# Altium schematic sheet Sheet1.SchDoc
size A4
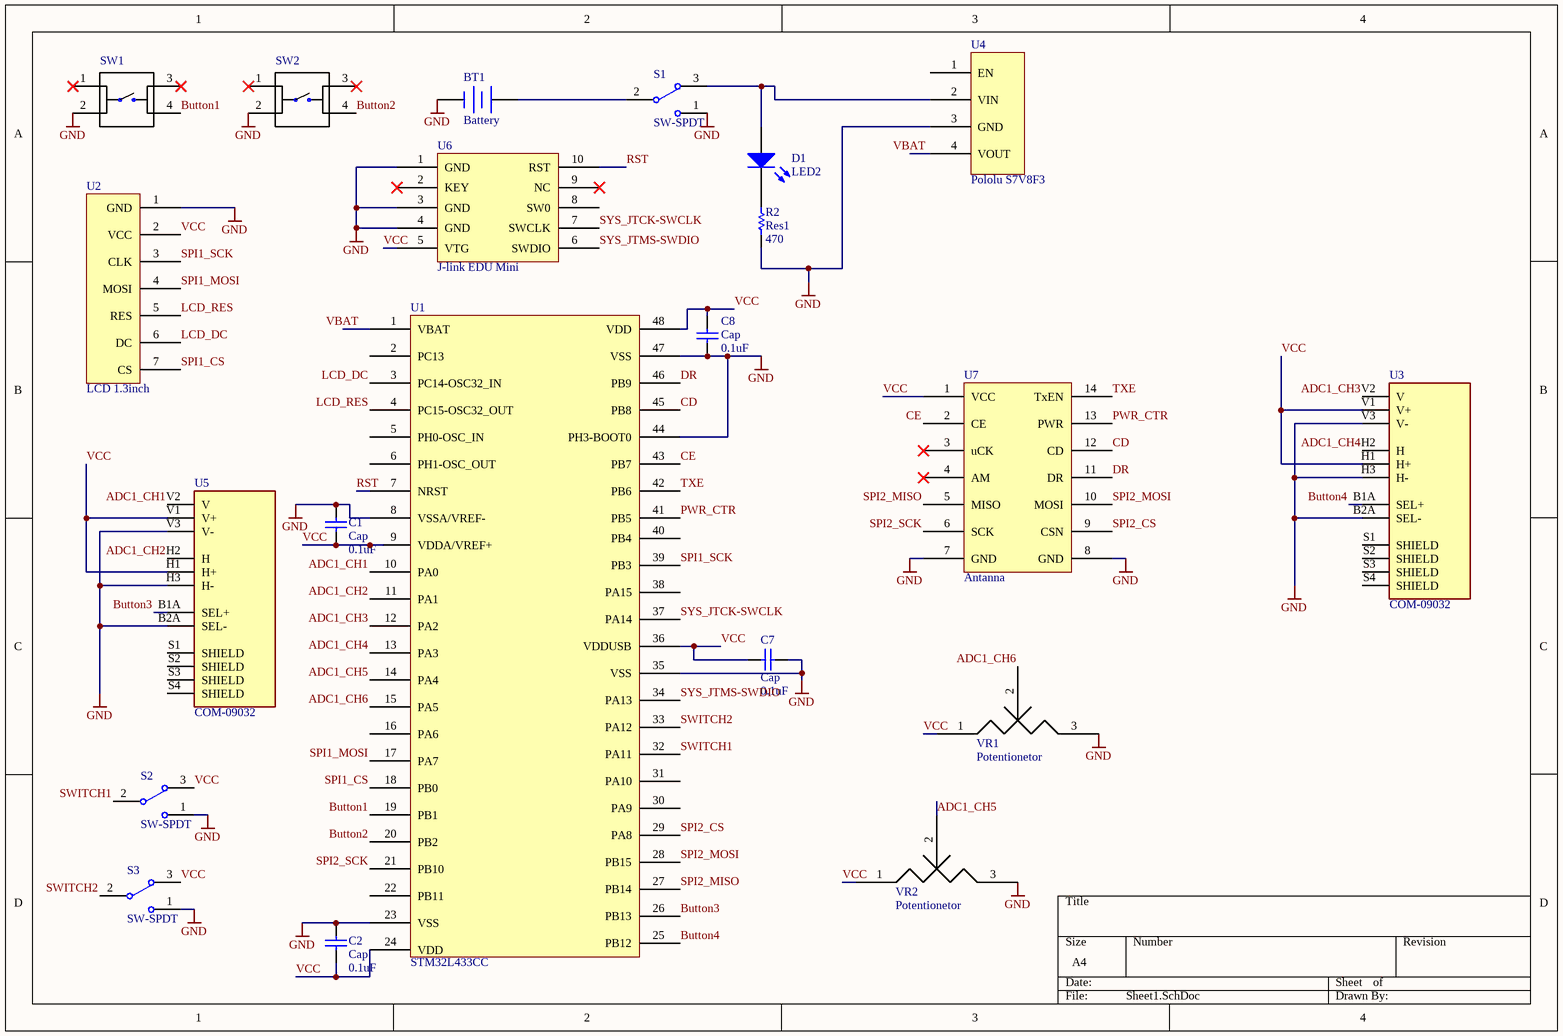
[diagram p0: Sheet1.SchDoc]

## Parts
BT1  Battery  [BAT-2]
C1  Cap  value 0.1uF  [RESC0603]
C2  Cap  value 0.1uF  [RESC0603]
C7  Cap  value 0.1uF  [RESC0603]
C8  Cap  value 0.1uF  [RESC0603]
D1  LED2  [LED1]
R2  Res1  value 470  [RESC0603]
S1  SW-SPDT  [Toggle switch]
S2  SW-SPDT  [Toggle switch]
S3  SW-SPDT  [Toggle switch]
SW1  1825910-6  [PUSHBUTTON SWITCH - duplicate]  (value not drawn)
SW2  1825910-6  [PUSHBUTTON SWITCH - duplicate]  (value not drawn)
U1  STM32L433CC  [LQFP48]
U2  LCD 1.3inch  [LCD]
U3  COM-09032  [XDCR_COM-09032]
U4  Pololu S7V8F3  [Pololu S7V8F3]
U5  COM-09032  [XDCR_COM-09032]
U6  J-link EDU Mini  [10 pin vertical]
U7  Antanna  [Antanna]
VR1  Potentionetor  [potentiometer]
VR2  Potentionetor  [potentiometer]

## Nets
GND: BT1.2(-) C1.2 C2.2 C7.1 C8.1 R2.1 S1.1 S2.1 S3.1 SW1.2 SW2.2 U1.8(VSSA/VREF-) U1.23(VSS) U1.35(VSS) U1.44(PH3-BOOT0) U1.47(VSS) U2.1(GND) U3.B2A(SEL-) U3.H3(H-) U3.V3(V-) U4.3(GND) U5.B2A(SEL-) U5.H3(H-) U5.V3(V-) U6.1(GND) U6.3(GND) U6.4(GND) U7.7(GND) U7.8(GND) VR1.3 VR2.3
ADC1_CH1: U1.10(PA0) U5.V2(V)
ADC1_CH2: U1.11(PA1) U5.H2(H)
ADC1_CH3: U1.12(PA2) U3.V2(V)
ADC1_CH4: U1.13(PA3) U3.H2(H)
ADC1_CH5: U1.14(PA4) VR2.2
ADC1_CH6: U1.15(PA5) VR1.2
Button1: SW1.4 U1.19(PB1)
Button2: SW2.4 U1.20(PB2)
Button3: U1.26(PB13) U5.B1A(SEL+)
Button4: U1.25(PB12) U3.B1A(SEL+)
CD: U1.45(PB8) U7.12(CD)
CE: U1.43(PB7) U7.2(CE)
DR: U1.46(PB9) U7.11(DR)
LCD_DC: U1.3(PC14-OSC32_IN) U2.6(DC)
LCD_RES: U1.4(PC15-OSC32_OUT) U2.5(RES)
PWR_CTR: U1.41(PB5) U7.13(PWR)
RST: U1.7(NRST) U6.10(RST)
SPI1_CS: U1.18(PB0) U2.7(CS)
SPI1_MOSI: U1.17(PA7) U2.4(MOSI)
SPI1_SCK: U1.39(PB3) U2.3(CLK)
SPI2_CS: U1.29(PA8) U7.9(CSN)
SPI2_MISO: U1.27(PB14) U7.5(MISO)
SPI2_MOSI: U1.28(PB15) U7.10(MOSI)
SPI2_SCK: U1.21(PB10) U7.6(SCK)
SWITCH1: S2.2 U1.32(PA11)
SWITCH2: S3.2 U1.33(PA12)
SYS_JTCK-SWCLK: U1.37(PA14) U6.7(SWCLK)
SYS_JTMS-SWDIO: U1.34(PA13) U6.6(SWDIO)
TXE: U1.42(PB6) U7.14(TxEN)
VBAT: U1.1(VBAT) U4.4(VOUT)
VCC: C1.1 C2.1 C7.2 C8.2 S2.3 S3.3 U1.9(VDDA/VREF+) U1.24(VDD) U1.36(VDDUSB) U1.48(VDD) U2.2(VCC) U3.H1(H+) U3.V1(V+) U5.H1(H+) U5.V1(V+) U6.5(VTG) U7.1(VCC) VR1.1 VR2.1
NetBT1_1: BT1.1(+) S1.2
NetD1_1: D1.1(A) S1.3 U4.2(VIN)
NetD1_2: D1.2(K) R2.2

Not connected (* = marked no-connect by the designer): SW1 1* 3*; SW2 1* 3*; U1 2(PC13) 5(PH0-OSC_IN) 6(PH1-OSC_OUT) 16(PA6) 22(PB11) 30(PA9) 31(PA10) 38(PA15) 40(PB4); U3 S1(SHIELD) S2(SHIELD) S3(SHIELD) S4(SHIELD); U4 1(EN); U5 S1(SHIELD) S2(SHIELD) S3(SHIELD) S4(SHIELD); U6 2(KEY)* 8(SW0) 9(NC)*; U7 3(uCK)* 4(AM)*

## Library data of the parts
BT1 = Battery: Multicell Battery; Published: 24-Mar-1999; LatestRevisionDate: 17-Jul-2002; LatestRevisionNote: Re-released for DXP Platform.; PackageReference: BAT-2; Publisher: Altium Limited; PackageDescription: Battery; 2 Leads
C1 C2 C7 C8 = Cap: Capacitor; Published: 8-Jun-2000; LatestRevisionDate: 17-Jul-2002; LatestRevisionNote: Re-released for DXP Platform.; PackageReference: RAD-0.3; Publisher: Altium Limited; PackageDescription: Radial Cap, Thru-Hole; 2 Leads; 0.3 in Pin Spacing
D1 = LED2: Typical RED, GREEN, YELLOW, AMBER GaAs LED; Published: 8-Jun-2000; LatestRevisionDate: 17-Jul-2002; LatestRevisionNote: Re-released for DXP Platform.; PackageVersion: Feb-2002; PackageReference: 3.2X1.6X1.1; Publisher: Altium Limited; PackageDescription: SM LED; 2 Flat Leads
R2 = Res1: Resistor; Published: 8-Jun-2000; LatestRevisionDate: 17-Jul-2002; LatestRevisionNote: Re-released for DXP Platform.; PackageReference: AXIAL-0.3; Publisher: Altium Limited; PackageDescription: Axial Device, Thru-Hole; 2 Leads; 0.3 in Pin Spacing
S1-S3 = SW-SPDT: SPDT Subminiature Toggle Switch, Right Angle Mounting, Vertical Actuation; Published: 24-Mar-1999; LatestRevisionDate: 17-Dec-2003; LatestRevisionNote: Schematic revised, PCB Footprint replaced.; DatasheetVersion: 05-Dec-2000; PackageReference: TL36WW15050; Publisher: Altium Limited; PackageDescription: Switch; 4 Leads; ComponentLink1Description: Manufacturer Link; ComponentLink1URL: http://www.apem.com
SW1 SW2 = 1825910-6: 6MM TACT SWITCH, HIGH TEMP; Configuration_Pole-Throw: Single Pole - Single Throw; Contact_Current_Rating: 50 mA; MF: TE Connectivity; TE_purchase_URL: https://www.te.com/usa-en/product-1825910-6.html?te_bu=Cor&te_type=disp&te_campaign=seda_glo_cor-seda-global-disp-prtnr-fy19-seda-model-bom-cta_sma-317_1&elqCampaignId=32493; EU_RoHS_Compliance: Compliant; SnapEDA_Link: https://www.snapeda.com/parts/1825910-6/TE%20Connectivity%20ALCOSWITCH%20Switches/view-part/?ref=snap; MP: 1825910-6; Digi-Key_Purchase_URL: https://www.digikey.com.au/product-detail/en/te-connectivity-alcoswitch-switches/1825910-6/450-1650-ND/1632536?utm_source=snapeda&utm_medium=aggregator&utm_campaign=symbol; Digi-Key_Part_Number: 450-1650-ND; Package: None; Value: *
U3 U5 = COM-09032: Joystick, 2 - Axis Analog _Resistive_ Output; MF: SparkFun Electronics; SnapEDA_Link: https://www.snapeda.com/parts/COM-09032/SparkFun%20Electronics/view-part/888157/?ref=snap; Availability: Unavailable; Value: *; Price: None; MP: COM-09032; Package: SparkFun Electronics